# Altium schematic sheet Power_Charge_USB.SchDoc
size A3; SheetNumber: 1; SheetTotal: 3
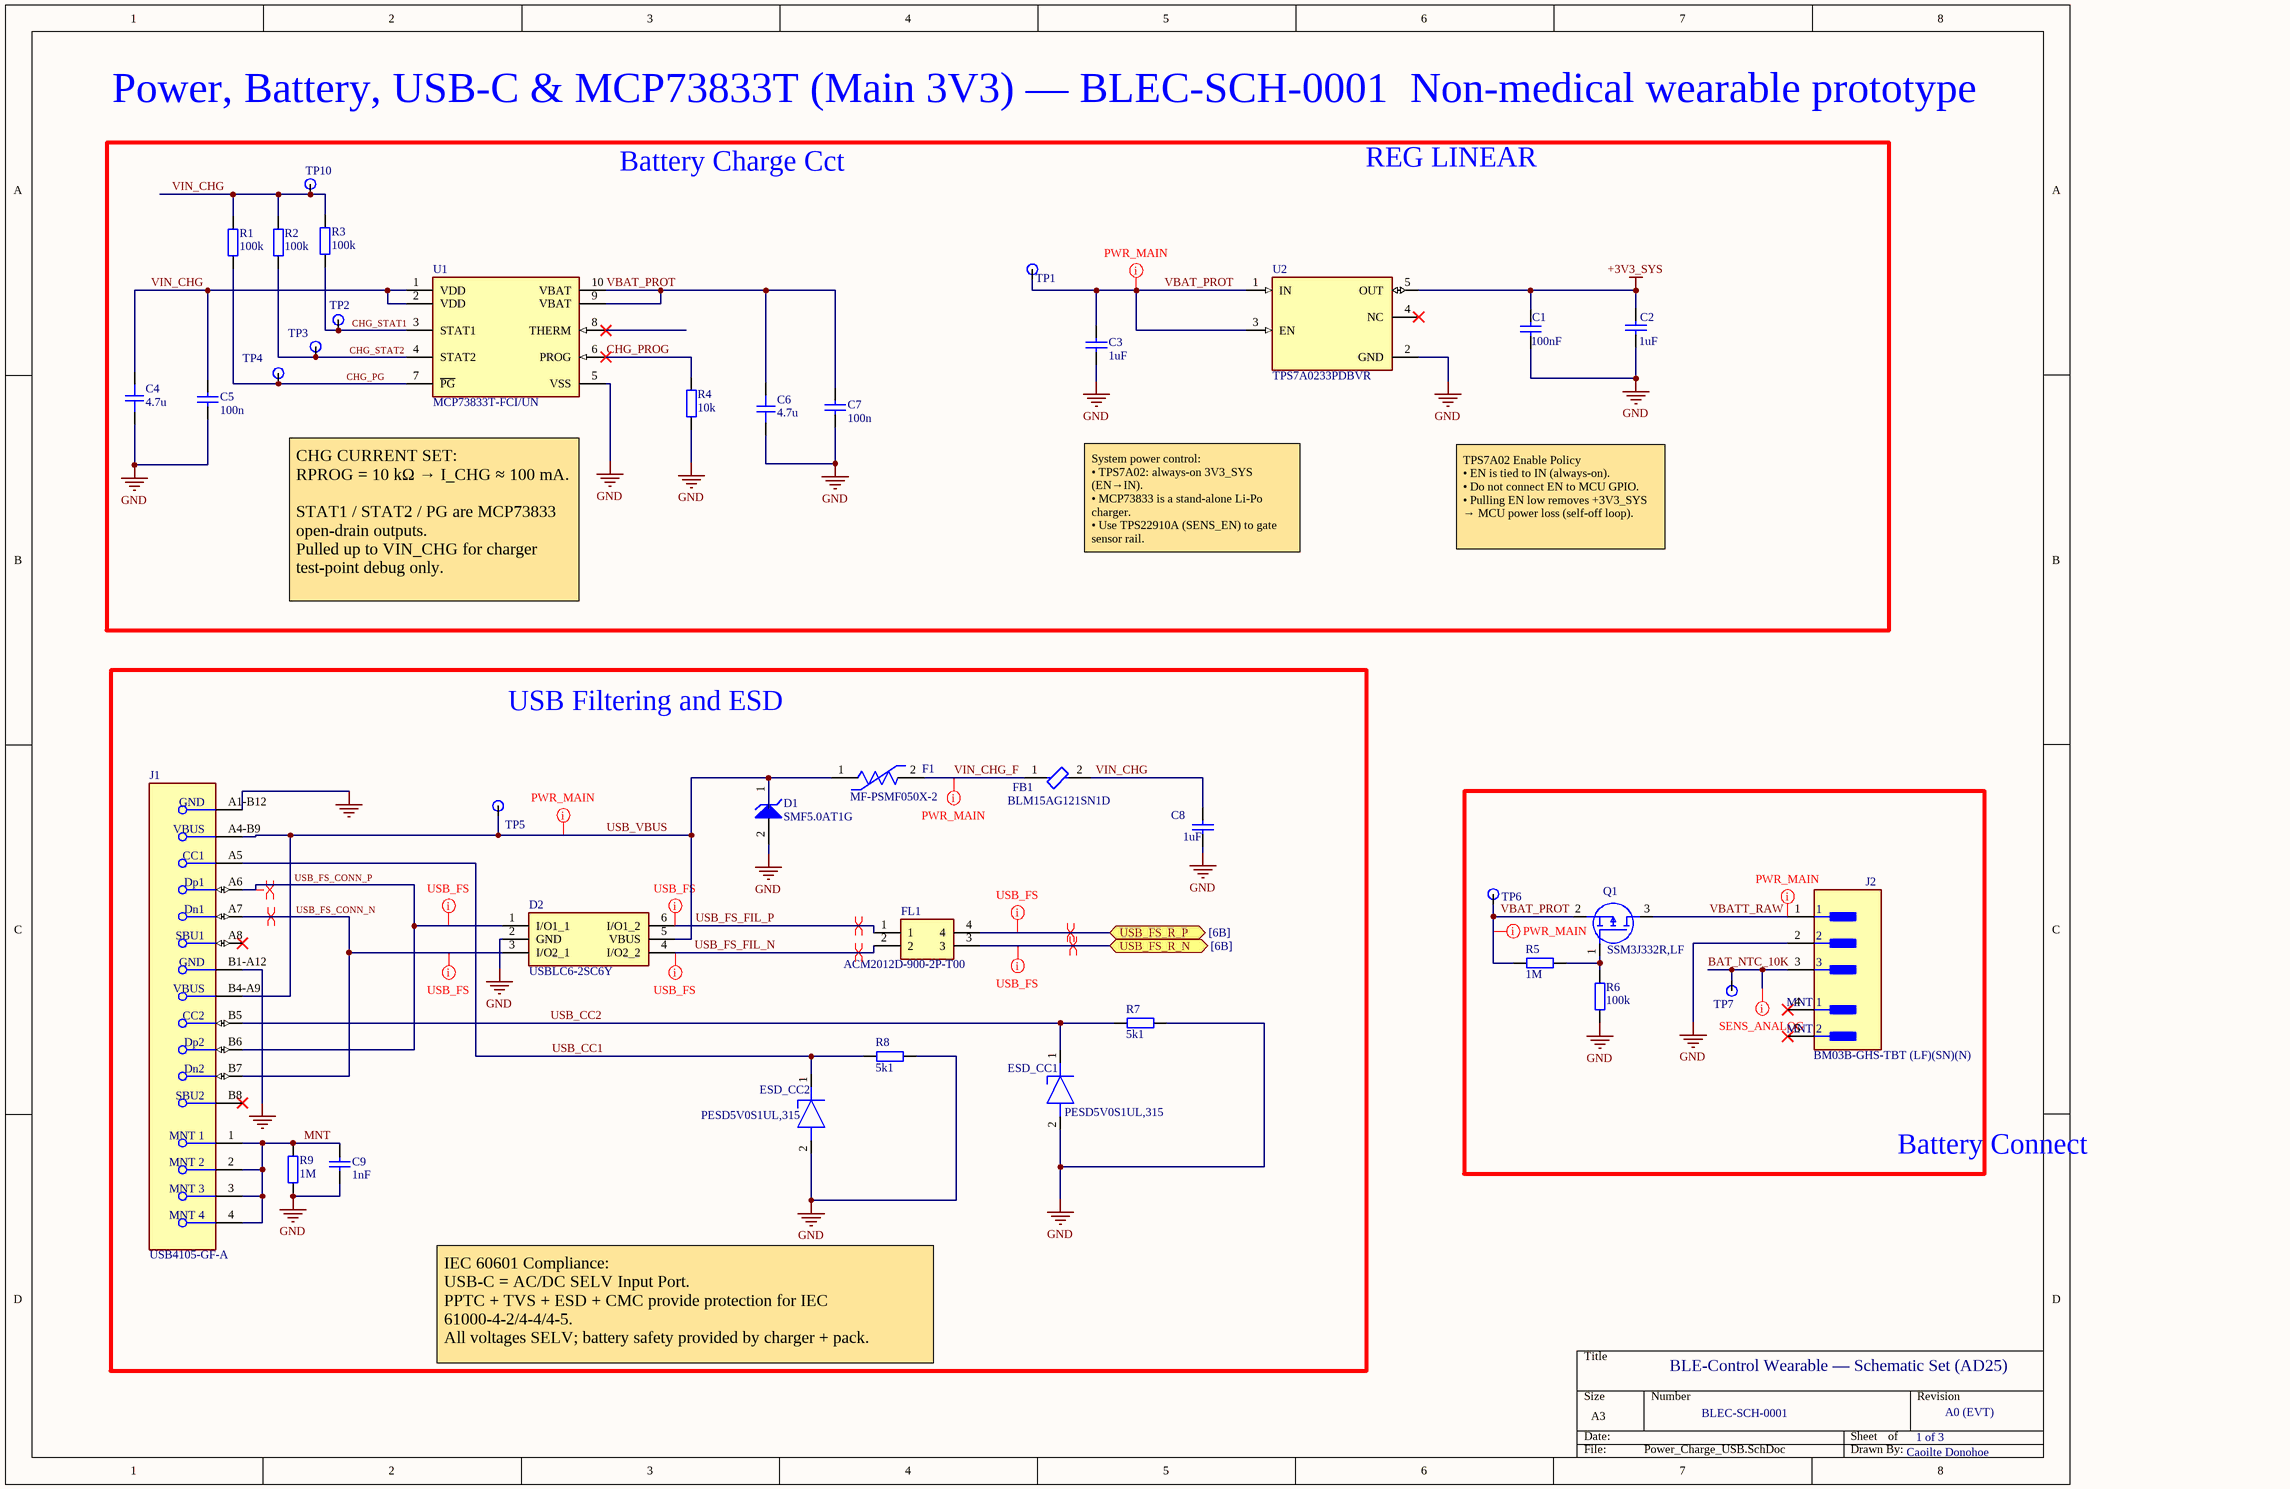
[diagram p0: Power_Charge_USB.SchDoc]

## Parts
C1  100nF  [CAP_0402]
C2  1uF  [CAP_0402]
C3  1uF  [CAP_0402]
C4  4.7u  [CAP_0603]
C5  100n  [CAP_0402]
C6  4.7u  [CAP_0603]
C7  100n  [CAP_0402]
C8  1uF  [CAP_0402]
C9  1nF  [CAP_0402]
D1  SMF5.0AT1G  [ONSC-SOD-123FL-2-498_V]
D2  USBLC6-2SC6Y  [SOT95P280X145-6N]
ESD_CC1  PESD5V0S1UL,315  [PESD5V0S1BL315]
ESD_CC2  PESD5V0S1UL,315  [PESD5V0S1BL315]
F1  MF-PSMF050X-2  [FP-MF-PSMF-MFG]
FB1  BLM15AG121SN1D  [FP-BLM15-0_05-IPC_A]
FL1  ACM2012D-900-2P-T00  [ACM2012D9002PT00]
J1  USB4105-GF-A  [FP-USB4105-GF-A-MFG]
J2  BM03B-GHS-TBT (LF)(SN)(N)  [FP-BM03B-GHS-TBT_LF_SN-MFG]
Q1  SSM3J332R,LF  [SSM3J332RLFT]
R1  100k  [RES_0603]
R2  100k  [RES_0603]
R3  100k  [RES_0603]
R4  10k  [RES_0402]
R5  1M  [RES_0402]
R6  100k  [RES_0402]
R7  5k1  [RES_0402]
R8  5k1  [RES_0402]
R9  1M  [RES_0402]
TP1  TestPoint  [PCBComponent_1]  (value not drawn)
TP2  USB_VBUS  [PCBComponent_1]  (value not drawn)
TP3  USB_VBUS  [PCBComponent_1]  (value not drawn)
TP4  USB_VBUS  [PCBComponent_1]  (value not drawn)
TP5  USB_VBUS  [PCBComponent_1]  (value not drawn)
TP6  VBAT_PROT  [PCBComponent_1]  (value not drawn)
TP7  BAT_NTC_10K  [PCBComponent_1]  (value not drawn)
TP10  (no value)  [TP_VIA_0p75]
U1  MCP73833T-FCI/UN  [FP-C04-021-IPC_B]
U2  TPS7A0233PDBVR  [FP-DBV0005A-IPC_A]

## Blocks framed on the sheet
USB Filtering and ESD: C8 C9 D1 D2 ESD_CC1 ESD_CC2 F1 FB1 FL1 J1 R7-R9 TP5
Battery Connect: J2 Q1 R5 R6 TP6 TP7

## Ports
USB_FS_R_N (bidir, see [6B]), USB_FS_R_P (bidir, see [6B])

## Nets
+3V3_SYS: C1.2 C2.2 U2.5(OUT)
GND: C1.1 C2.1 C3.1 C4.1 C5.1 C6.1 C7.1 C8.1 C9.1 D1.2(A) D2.2(GND) ESD_CC1.2(A) ESD_CC2.2(A) J1.A1-B12(GND) J1.B1-A12(GND) J2.2 R4.1 R6.1 R7.2 R8.2 R9.1 U1.5(VSS) U2.2(GND)
BAT_NTC_10K: J2.3 TP7.1
CHG_PG: R1.1 TP4.1 U1.7(~{PG})
CHG_PROG: R4.2 U1.6(PROG)
CHG_STAT1: R3.1 TP2.1 U1.3(STAT1)
CHG_STAT2: R2.1 TP3.1 U1.4(STAT2)
MNT: C9.2 J1.1(MNT_1) J1.2(MNT_2) J1.3(MNT_3) J1.4(MNT_4) R9.2
USB_CC1: ESD_CC2.1(K) J1.A5(CC1) R8.1
USB_CC2: ESD_CC1.1(K) J1.B5(CC2) R7.1
USB_FS_CONN_N: D2.3(I/O2_1) J1.A7(Dn1) J1.B7(Dn2)
USB_FS_CONN_P: D2.1(I/O1_1) J1.A6(Dp1) J1.B6(Dp2)
USB_FS_FIL_N: D2.4(I/O2_2) FL1.2
USB_FS_FIL_P: D2.6(I/O1_2) FL1.1
USB_FS_R_N: FL1.3 ; port USB_FS_R_N
USB_FS_R_P: FL1.4 ; port USB_FS_R_P
USB_VBUS: D1.1(K) D2.5(VBUS) F1.1 J1.A4-B9(VBUS) J1.B4-A9(VBUS) TP5.1
VBAT_PROT: C3.2 C6.2 C7.2 Q1.2(S) R5.1 TP1.1 TP6.1 U1.9(VBAT) U1.10(VBAT) U2.1(IN) U2.3(EN)
VBATT_RAW: J2.1 Q1.3(D)
VIN_CHG: C4.2 C5.2 C8.2 FB1.2 R1.2 R2.2 R3.2 TP10.1 U1.1(VDD) U1.2(VDD)
VIN_CHG_F: F1.2 FB1.1
NetQ1_1: Q1.1(G) R5.2 R6.2

Not connected (* = marked no-connect by the designer): J1 A8(SBU1)* B8(SBU2)*; J2 4(MNT_1)* 5(MNT_2)*; U1 8(THERM)*; U2 4(NC)*

## Layout directives
differential pair; differential pair class USB: USB_FS_CONN_N, USB_FS_CONN_P, USB_FS_FIL_N, USB_FS_FIL_P, USB_FS_R_N, USB_FS_R_P
net class USB_FS: USB_FS_CONN_N, USB_FS_CONN_P, USB_FS_FIL_N, USB_FS_FIL_P, USB_FS_R_N, USB_FS_R_P
net class PWR_MAIN: USB_VBUS, VBAT_PROT, VBATT_RAW, VIN_CHG_F
net class SENS_ANALOG: BAT_NTC_10K

## Notes on the sheet
- Power, Battery, USB-C & MCP73833T (Main 3V3) — BLEC-SCH-0001  Non-medical wearable prototype
- Battery Charge Cct
- REG LINEAR
- System power control:
  • TPS7A02: always-on 3V3_SYS (EN→IN).
  • MCP73833 is a stand-alone Li-Po charger.
  • Use TPS22910A (SENS_EN) to gate sensor rail.
- TPS7A02 Enable Policy
  • EN is tied to IN (always-on).
  • Do not connect EN to MCU GPIO.
  • Pulling EN low removes +3V3_SYS → MCU power loss (self-off loop).
- CHG CURRENT SET:
  RPROG = 10 kΩ → I_CHG ≈ 100 mA.
  STAT1 / STAT2 / PG are MCP73833 open-drain outputs.
  Pulled up to VIN_CHG for charger test-point debug only.
- IEC 60601 Compliance:
  USB-C = AC/DC SELV Input Port.
  PPTC + TVS + ESD + CMC provide protection for IEC 61000-4-2/4-4/4-5.
  All voltages SELV; battery safety provided by charger + pack.
- BLE-Control Wearable — Schematic Set (AD25)
- BLEC-SCH-0001
- 1 of 3
- A0 (EVT)
- Caoilte Donohoe

## Library data of the parts
C1-C3 C5 C7 = C_0402: Ceramic Chip Capacitor 0402; Voltage: 10V; Dielectric: X7R; Tolerance: 10%; ProductionStatus: Placeholder; Package: 0402 (1005); Height: 0.35mm
C4 C6 = CAP_0603: Capacitor SMD 0603; Manufacturer: *; Manufacturer Part Number: *; Distributor Link: *; LCSC: *; Rating: *; Dielectric: *
C8 C9 = C_0402: Ceramic Chip Capacitor 0402; PartNumber: C1005X5R1E105K; Voltage: 10V; Dielectric: X7R; Tolerance: 10%; ProductionStatus: Placeholder; Package: 0402 (1005); Height: 0.35mm; Part Number: C1005X5R1E105K
D1 = CMP-1061-00612-1: 200 W Transient Voltage Suppressor, 2-Pin SOD-123FL, Pb-Free, Tape and Reel; Manufacturer: On Semiconductor; Direction: Unidirectional; IR Max (uA): 400; V(BR) Typ (V): 6.7; PackageDescription: 2-Pin SOD, Body 1.65 x 2.7 mm; PartNumber: SMF5.0AT1G; ComponentLink3Description: Package Specification; ComponentLink3URL: http://www.onsemi.com/pub_link/Collateral/498-01.PDF; PackageVersion: Rev. D, 05/2013; Mounting Technology: Surface Mount; PackageReference: SOD-123FL-2-498; ComponentLink2URL: http://www.onsemi.com/pub_link/Collateral/SMF5.0AT1-D.PDF; DatasheetVersion: Rev. 7; ComponentLink1Description: Manufacturer URL; Packing: Tape and Reel; RoHS: Pb-Free; ComponentLink1URL: http://www.onsemi.com/; ComponentLink2Description: Datasheet
D2 = USBLC6-2SC6Y: Diode; Manufacturer_Name: STMicroelectronics; Datasheet Link: https://componentsearchengine.com/Datasheets/1/USBLC6-2SC6Y.pdf; Height: 1.45mm; Manufacturer_Part_Number: USBLC6-2SC6Y; Mouser Part Number: 511-USBLC6-2SC6Y; Mouser Price/Stock: https://www.mouser.co.uk/ProductDetail/STMicroelectronics/USBLC6-2SC6Y?qs=gNDSiZmRJS%2FOgDexvXkdow%3D%3D; Arrow Part Number: USBLC6-2SC6Y; Arrow Price/Stock: https://www.arrow.com/en/products/usblc6-2sc6y/stmicroelectronics?utm_currency=USD&region=nac
ESD_CC1 ESD_CC2 = PESD5V0S1UL,315: Diode ESD (Uni-directional); Manufacturer_Name: Nexperia; Datasheet Link: https://assets.nexperia.com/documents/data-sheet/PESD5V0S1UL.pdf; Height: 0mm; Manufacturer_Part_Number: PESD5V0S1UL,315; Mouser Part Number: 771-PESD5V0S1UL315; Mouser Price/Stock: https://www.mouser.co.uk/ProductDetail/Nexperia/PESD5V0S1UL315?qs=LOCUfHb8d9sSC%2FUB7ugsVw%3D%3D; Arrow Part Number: PESD5V0S1UL,315; Arrow Price/Stock: https://www.arrow.com/en/products/pesd5v0s1ul315/nexperia?utm_currency=USD&region=nac
F1 = CMP-07400-000013-1: PTC RESET FUSE 6V 500MA 0805; Manufacturer: Bourns Inc.; Trip Current: 1A; Trip Time: 0.1s; Value: 0.15-0.9Ω; Hold Current: 0.5A; Current Rating: 40A; Category: Fuse; Temperature: -40°C to +85°C; ComponentLink2Description: Datasheet; Manufacturer Part Number: MF-PSMF050X-2; Temperature Range High: +85°C; Package: MF-PSMF; Device Class L1: Circuit Protection; Lead Free: Yes; ComponentLink2URL: https://www.bourns.com/docs/product-datasheets/mfpsmf.pdf?sfvrsn=9c05cafe_24; Ambient Temperature Range Low: -40°C; Mouser Description: Resettable Fuses - PPTC .50A 6V 0.15ohm Hold .5 Trip 1; Resistance: 0.15-0.9Ω; Automotive: Yes; Ambient Temperature Range High: +85°C; Device Class L2: PTC Resettable Fuses; Temperature Range Low: -40°C; Device Class L3: unset; Octopart: https://octopart.com/mf-psmf050x-2-bourns-7483438; Digikey Description: PTC RESET FUSE 6V 500MA 0805; Height: 0.85mm; RoHS: TRUE; Voltage Rating: 6V
FB1 = CMP-0686-00170-4: Chip Ferrite Bead, 0402, 120Ω @ 100MHz, 0.19Ω, 25%, 550mA; Material: Steel; Max DC Current: 500mA; Shielding: Unshielded; Number of Lines: 1; DC Resistance (DCR): 190mR; Impedance: 120R; Packaging: Tape and Reel; Core Material: Ferrite; Number of Pins: 2; Tolerance: 25%; Case Code (Imperial): 0402; DC Current: 500mA; Termination: SMD/SMT; Height: 0.5mm; REACH SVHC: No SVHC; Max Operating Temperature: 125°C; Case Code (Metric): 1005; Length: 1mm; Test Frequency: 100MHz; Lead Free: Lead Free; Depth: 0.55mm; Max Current Rating: 550mA; Case/Package: 0402; Min Operating Temperature: -55°C; Width: 0.5mm; Military Standard: Not; Frequency: 100MHz; Current Rating: 550mA; Package Quantity: 1; Number of Circuits: 1; Radiation Hardening: No
FL1 = ACM2012D-900-2P-T00: Filter; Manufacturer_Name: TDK; Datasheet Link: https://product.tdk.com/en/search/emc/emc/cmf_cmc/info/print_pdf; Height: 1.3mm; Manufacturer_Part_Number: ACM2012D-900-2P-T00; Mouser Part Number: 810-ACM2012D9002PT00; Mouser Price/Stock: https://www.mouser.co.uk/ProductDetail/TDK/ACM2012D-900-2P-T00?qs=uxmvvYJjMIufvI0tFhRfZA%3D%3D; Arrow Part Number: ACM2012D-900-2P-T00; Arrow Price/Stock: https://www.arrow.com/en/products/acm2012d-900-2p-t00/tdk?utm_currency=USD&region=nac
J1 = CMP-245163-000001-1: CONN RCPT USB2.0 TYPEC 5A; Manufacturer: GCT; Voltage Rating: 20V; Is Female: yes; Current Rating: 5/6.25/1.25/0.25A; Number Of Contacts: 16; Conn Orientation: Right Angle; Device Class L1: Connectors; Category: Conn; Lead Free: Yes; RoHS: TRUE; Temperature Range High: +85°C; Digikey Description: CONN RCPT USB2.0 TYPEC 5A; Device Class L3: unset; ComponentLink2Description: Datasheet; Manufacturer Part Number: USB4105-GF-A; Package: 0; Usb Standard: USB 2.0; Device Class L2: USB Connectors; Automotive: No; Temperature Range Low: -40°C; Height: 3.46mm; Temperature: -40°C to +85°C; Contact Material: Gold,Nickel; ComponentLink2URL: https://gct.co/files/drawings/usb4105.pdf; Octopart: https://octopart.com/usb4105-gf-a-gct-106627878
J2 = CMP-17439-000616-1: CONN HEADER SMD 3POS 1.25MM; Mated Stacking Heights: 7.3mm; Voltage Rating: 50V; Pitch: 0.049inch; Number of Positions: 3; Contact Material: Bronze; Number of Rows: 1; Packaging: Cut Tape; Fastening Type: Ramp; Contact Shape: Rectangular; Termination: Solder; Flammability Rating: UL94 V-0; Lead Free: Lead Free; Color: Natural; Mount: Surface Mount; Contact Finish - Mating: TIN; Max Operating Temperature: 85°C; Series: GH; Insulation Color: Natural; Connector Type: Header; Insulation Material: Nylon; Contact Type: Outer Shroud Contact; Min Operating Temperature: -25°C; Contact Plating: Tin
Q1 = SSM3J332R,LF: MOSFET (P-Channel); Manufacturer_Name: Toshiba; Datasheet Link: https://www.mouser.com/datasheet/2/408/SSM3J332R_datasheet_en_20181015-1150575.pdf; Manufacturer_Part_Number: SSM3J332R,LF; Mouser Part Number: 757-SSM3J332RLF; Mouser Price/Stock: https://www.mouser.co.uk/ProductDetail/Toshiba/SSM3J332RLF?qs=%252B8yZ8wZTKG5UW86maIHWeg%3D%3D; Arrow Part Number: SSM3J332R,LF; Arrow Price/Stock: https://www.arrow.com/en/products/ssm3j332rlf/toshiba?region=nac
R1-R3 = RES_0603: Resistor SMD 0603; Manufacturer: *; Manufacturer Part Number: *; Distributor Link: *; LCSC: *
R4-R9 = R_0402: Resistor SMD 0402; Manufacturer: *; Manufacturer Part Number: *; Distributor Link: *; LCSC: *
TP2-TP7 TP10 = TestPoint
U1 = MCP73833T-FCI-UN: IC LI-ION/LI-POLY CTRLR 10MSOP; Output Voltage: 4.5V; Min Supply Voltage: 3.75V; Output Current: 1.2A; Number of Cells: 1; Max Charge Current: 1.1A; Battery Pack Voltage: 4.2V; Max Supply Voltage: 6V; Fault Protection: Over Temperature; Mount: Surface Mount; Number of Pins: 10; Lead Free: Lead Free; Min Operating Temperature: -40°C; Radiation Hardening: No; Case/Package: MSOP; Max Operating Temperature: 85°C; Packaging: Tape and Reel; Package Quantity: 2500
U2 = CMP-04917-000286-1: IC REG LINEAR 3.3V 200MA SOT23-5; RoHS Compliant: Yes